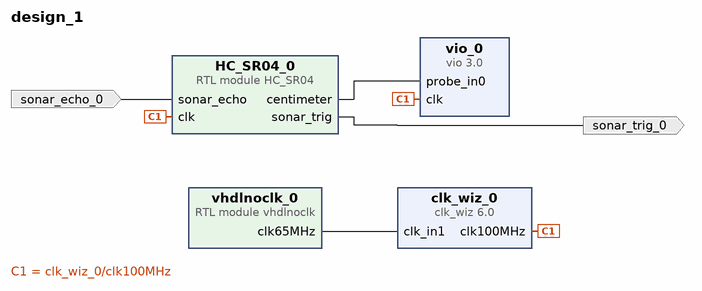
[diagram p0: block diagram of the top level]
# Vivado block design design_1, xc7z007sclg225-1, Vivado 2019.1.3
create_bd_design design_1

create_bd_port -dir I sonar_echo_0
create_bd_port -dir O sonar_trig_0

create_bd_cell -type module -reference vhdlnoclk vhdlnoclk_0
create_bd_cell -type ip -vlnv xilinx.com:ip:clk_wiz:6.0 clk_wiz_0
set_property -dict [list \
  CONFIG.CLKIN1_JITTER_PS 153.84 \
  CONFIG.CLKOUT1_JITTER 147.748 \
  CONFIG.CLKOUT1_PHASE_ERROR 109.791 \
  CONFIG.CLKOUT1_REQUESTED_OUT_FREQ 100 \
  CONFIG.CLK_OUT1_PORT clk100MHz \
  CONFIG.ENABLE_CLOCK_MONITOR false \
  CONFIG.MMCM_CLKFBOUT_MULT_F 15.000 \
  CONFIG.MMCM_CLKIN1_PERIOD 15.385 \
  CONFIG.MMCM_CLKIN2_PERIOD 10.0 \
  CONFIG.MMCM_CLKOUT0_DIVIDE_F 9.750 \
  CONFIG.PRIMITIVE MMCM \
  CONFIG.PRIM_IN_FREQ 65 \
  CONFIG.USE_LOCKED false \
  CONFIG.USE_RESET false \
] [get_bd_cells clk_wiz_0]
create_bd_cell -type module -reference HC_SR04 HC_SR04_0
create_bd_cell -type ip -vlnv xilinx.com:ip:vio:3.0 vio_0
set_property -dict {CONFIG.C_NUM_PROBE_OUT 0} [get_bd_cells vio_0]

# ---- connections ----

connect_bd_net [get_bd_pins vhdlnoclk_0/clk65MHz] [get_bd_pins clk_wiz_0/clk_in1]
connect_bd_net [get_bd_pins clk_wiz_0/clk100MHz] [get_bd_pins HC_SR04_0/clk] [get_bd_pins vio_0/clk]
connect_bd_net -net sonar_echo_0_1 [get_bd_ports sonar_echo_0] [get_bd_pins HC_SR04_0/sonar_echo]
connect_bd_net [get_bd_pins HC_SR04_0/sonar_trig] [get_bd_ports sonar_trig_0]
connect_bd_net [get_bd_pins HC_SR04_0/centimeter] [get_bd_pins vio_0/probe_in0]

validate_bd_design
save_bd_design
